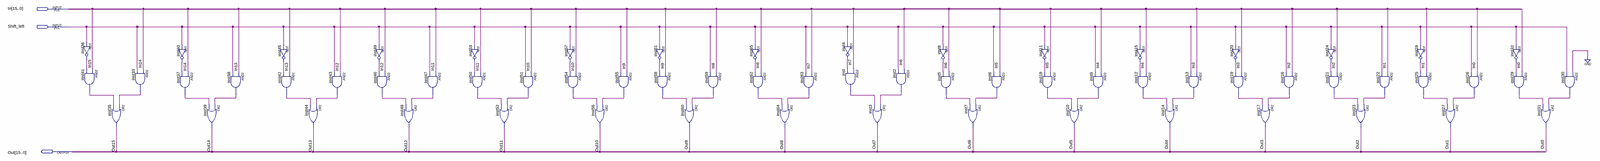
[diagram p0: schematic sheet, whole]
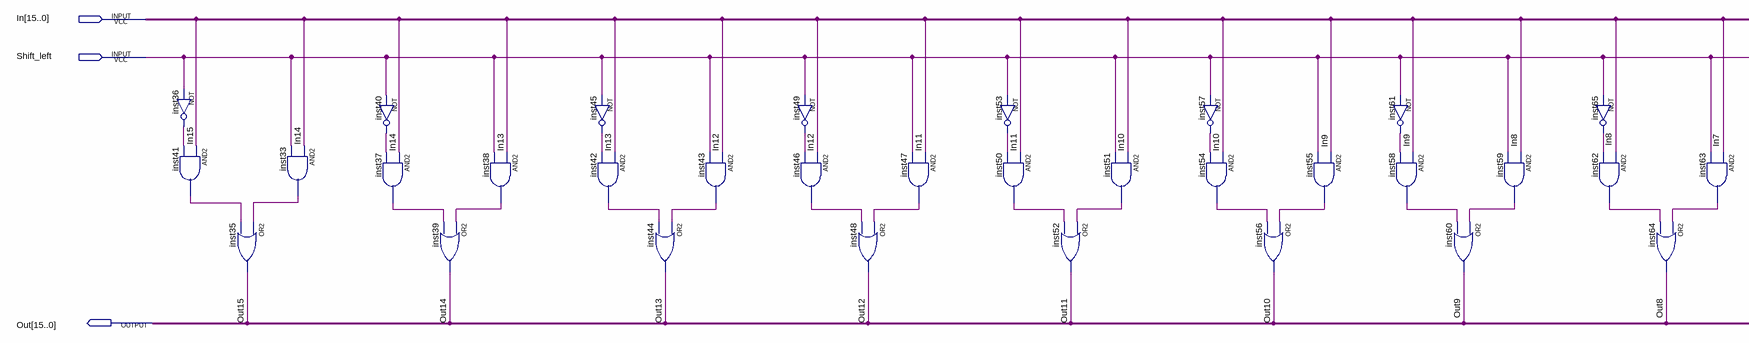
[diagram p1: schematic sheet, left part]
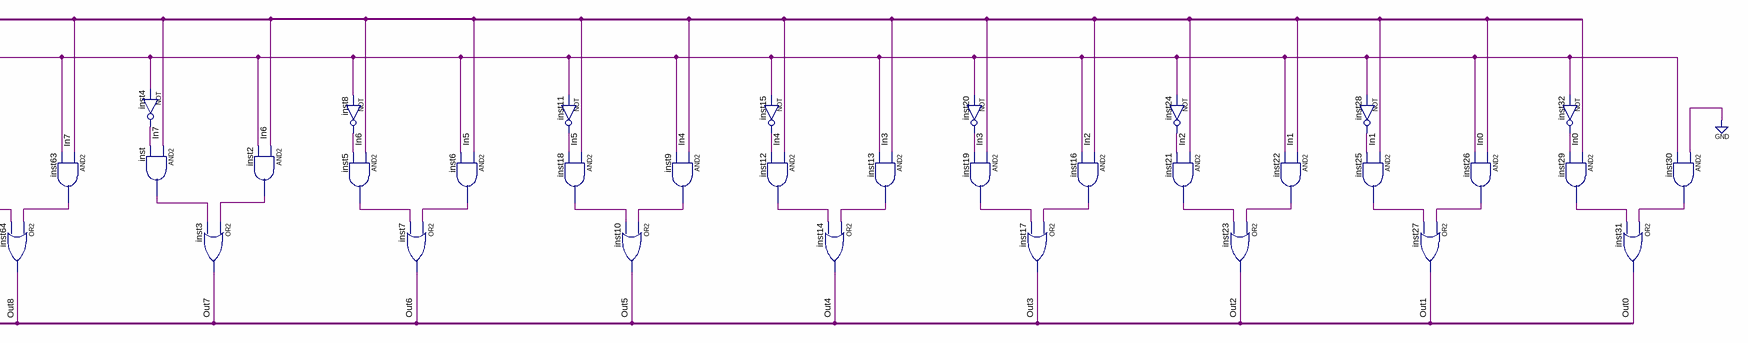
[diagram p2: schematic sheet, right part]
// Quartus schematic shift_left_1.bdf as structural Verilog: 64 symbols, 3 pins
module shift_left_1 (
  input  [15:0] In,
  input  Shift_left,
  output [15:0] Out
);

  wire inst2_out, inst4_out, inst5_out, inst6_out, inst8_out, inst9_out, inst11_out, inst12_out, inst13_out,
       inst15_out, inst16_out, inst18_out, inst19_out, inst20_out, inst21_out, inst22_out, inst24_out,
       inst25_out, inst26_out, inst28_out, inst29_out, inst30_out, inst32_out, inst33_out, inst36_out,
       inst37_out, inst38_out, inst40_out, inst41_out, inst42_out, inst43_out, inst45_out, inst46_out,
       inst47_out, inst49_out, inst50_out, inst51_out, inst53_out, inst54_out, inst55_out, inst57_out,
       inst58_out, inst59_out, inst61_out, inst62_out, inst63_out, inst65_out, inst_out;

  not inst36 (inst36_out, Shift_left);
  and inst41 (inst41_out, In[15], inst36_out);
  or inst35 (Out[15], inst33_out, inst41_out);
  and inst33 (inst33_out, In[14], Shift_left);
  not inst40 (inst40_out, Shift_left);
  and inst37 (inst37_out, In[14], inst40_out);
  or inst39 (Out[14], inst38_out, inst37_out);
  and inst38 (inst38_out, In[13], Shift_left);
  not inst45 (inst45_out, Shift_left);
  and inst42 (inst42_out, In[13], inst45_out);
  or inst44 (Out[13], inst43_out, inst42_out);
  and inst43 (inst43_out, In[12], Shift_left);
  not inst49 (inst49_out, Shift_left);
  and inst46 (inst46_out, In[12], inst49_out);
  or inst48 (Out[12], inst47_out, inst46_out);
  and inst47 (inst47_out, In[11], Shift_left);
  not inst53 (inst53_out, Shift_left);
  and inst50 (inst50_out, In[11], inst53_out);
  or inst52 (Out[11], inst51_out, inst50_out);
  and inst51 (inst51_out, In[10], Shift_left);
  not inst57 (inst57_out, Shift_left);
  and inst54 (inst54_out, In[10], inst57_out);
  or inst56 (Out[10], inst55_out, inst54_out);
  and inst55 (inst55_out, In[9], Shift_left);
  not inst61 (inst61_out, Shift_left);
  and inst58 (inst58_out, In[9], inst61_out);
  or inst60 (Out[9], inst59_out, inst58_out);
  and inst59 (inst59_out, In[8], Shift_left);
  not inst65 (inst65_out, Shift_left);
  and inst62 (inst62_out, In[8], inst65_out);
  or inst64 (Out[8], inst63_out, inst62_out);
  and inst63 (inst63_out, In[7], Shift_left);
  not inst4 (inst4_out, Shift_left);
  and inst (inst_out, In[7], inst4_out);
  or inst3 (Out[7], inst2_out, inst_out);
  and inst2 (inst2_out, In[6], Shift_left);
  not inst8 (inst8_out, Shift_left);
  and inst5 (inst5_out, In[6], inst8_out);
  or inst7 (Out[6], inst6_out, inst5_out);
  and inst6 (inst6_out, In[5], Shift_left);
  not inst11 (inst11_out, Shift_left);
  and inst18 (inst18_out, In[5], inst11_out);
  or inst10 (Out[5], inst9_out, inst18_out);
  and inst9 (inst9_out, In[4], Shift_left);
  not inst15 (inst15_out, Shift_left);
  and inst12 (inst12_out, In[4], inst15_out);
  or inst14 (Out[4], inst13_out, inst12_out);
  and inst13 (inst13_out, In[3], Shift_left);
  not inst20 (inst20_out, Shift_left);
  and inst19 (inst19_out, In[3], inst20_out);
  or inst17 (Out[3], inst16_out, inst19_out);
  and inst16 (inst16_out, In[2], Shift_left);
  not inst24 (inst24_out, Shift_left);
  and inst21 (inst21_out, In[2], inst24_out);
  or inst23 (Out[2], inst22_out, inst21_out);
  and inst22 (inst22_out, In[1], Shift_left);
  not inst28 (inst28_out, Shift_left);
  and inst25 (inst25_out, In[1], inst28_out);
  or inst27 (Out[1], inst26_out, inst25_out);
  and inst26 (inst26_out, In[0], Shift_left);
  not inst32 (inst32_out, Shift_left);
  and inst29 (inst29_out, In[0], inst32_out);
  or inst31 (Out[0], inst30_out, inst29_out);
  and inst30 (inst30_out, 1'b0, Shift_left);
endmodule
